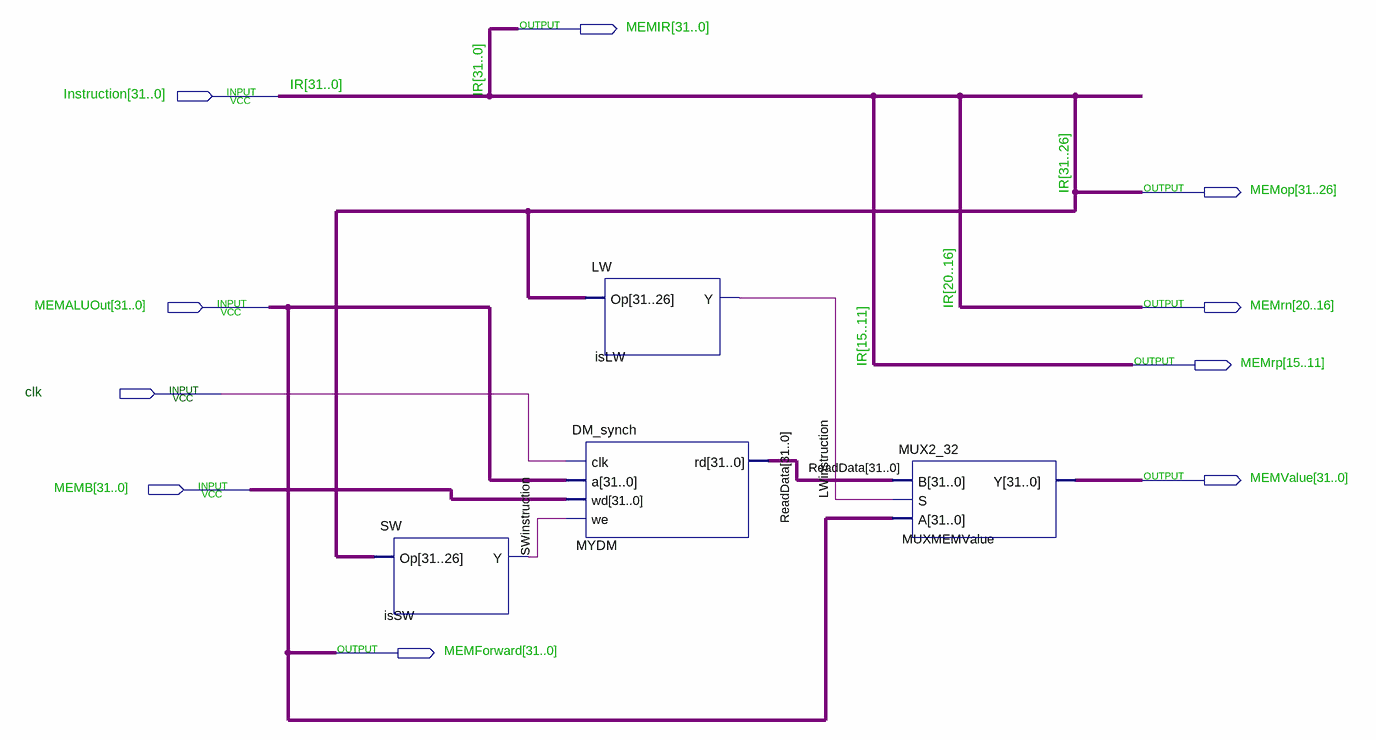
[diagram p0: schematic sheet]
// Quartus schematic MEMM.bdf as structural Verilog: 4 symbols, 10 pins
module MEMM (
  input  [31:0] Instruction,
  input  [31:0] MEMALUOut,
  input  clk,
  input  [31:0] MEMB,
  output [31:0] MEMIR,
  output [31:26] MEMop,
  output [20:16] MEMrn,
  output [15:11] MEMrp,
  output [31:0] MEMValue,
  output [31:0] MEMForward
);

  wire LWinstruction, SWinstruction;
  wire [31:0] ReadData;

  SW isSW (.Op(Instruction[31:26]), .Y(SWinstruction));
  LW isLW (.Op(Instruction[31:26]), .Y(LWinstruction));
  DM_synch MYDM (.clk(clk), .a(MEMALUOut), .wd(MEMB), .we(SWinstruction), .rd(ReadData));
  MUX2_32 MUXMEMValue (.B(ReadData), .S(LWinstruction), .A(MEMALUOut), .Y(MEMValue));

  assign MEMForward = MEMALUOut;
  assign MEMIR = Instruction;
  assign MEMop = Instruction[31:26];
  assign MEMrn = Instruction[20:16];
  assign MEMrp = Instruction[15:11];

  // Other names for the same wires on the sheet: IR[31:0] = Instruction
endmodule
